# EAGLE design AS226279_ECE319K_Baseline_Schematic (EAGLE 9.6.2)
Spring 2022 EE319K/EE319H This is the baseline schematic
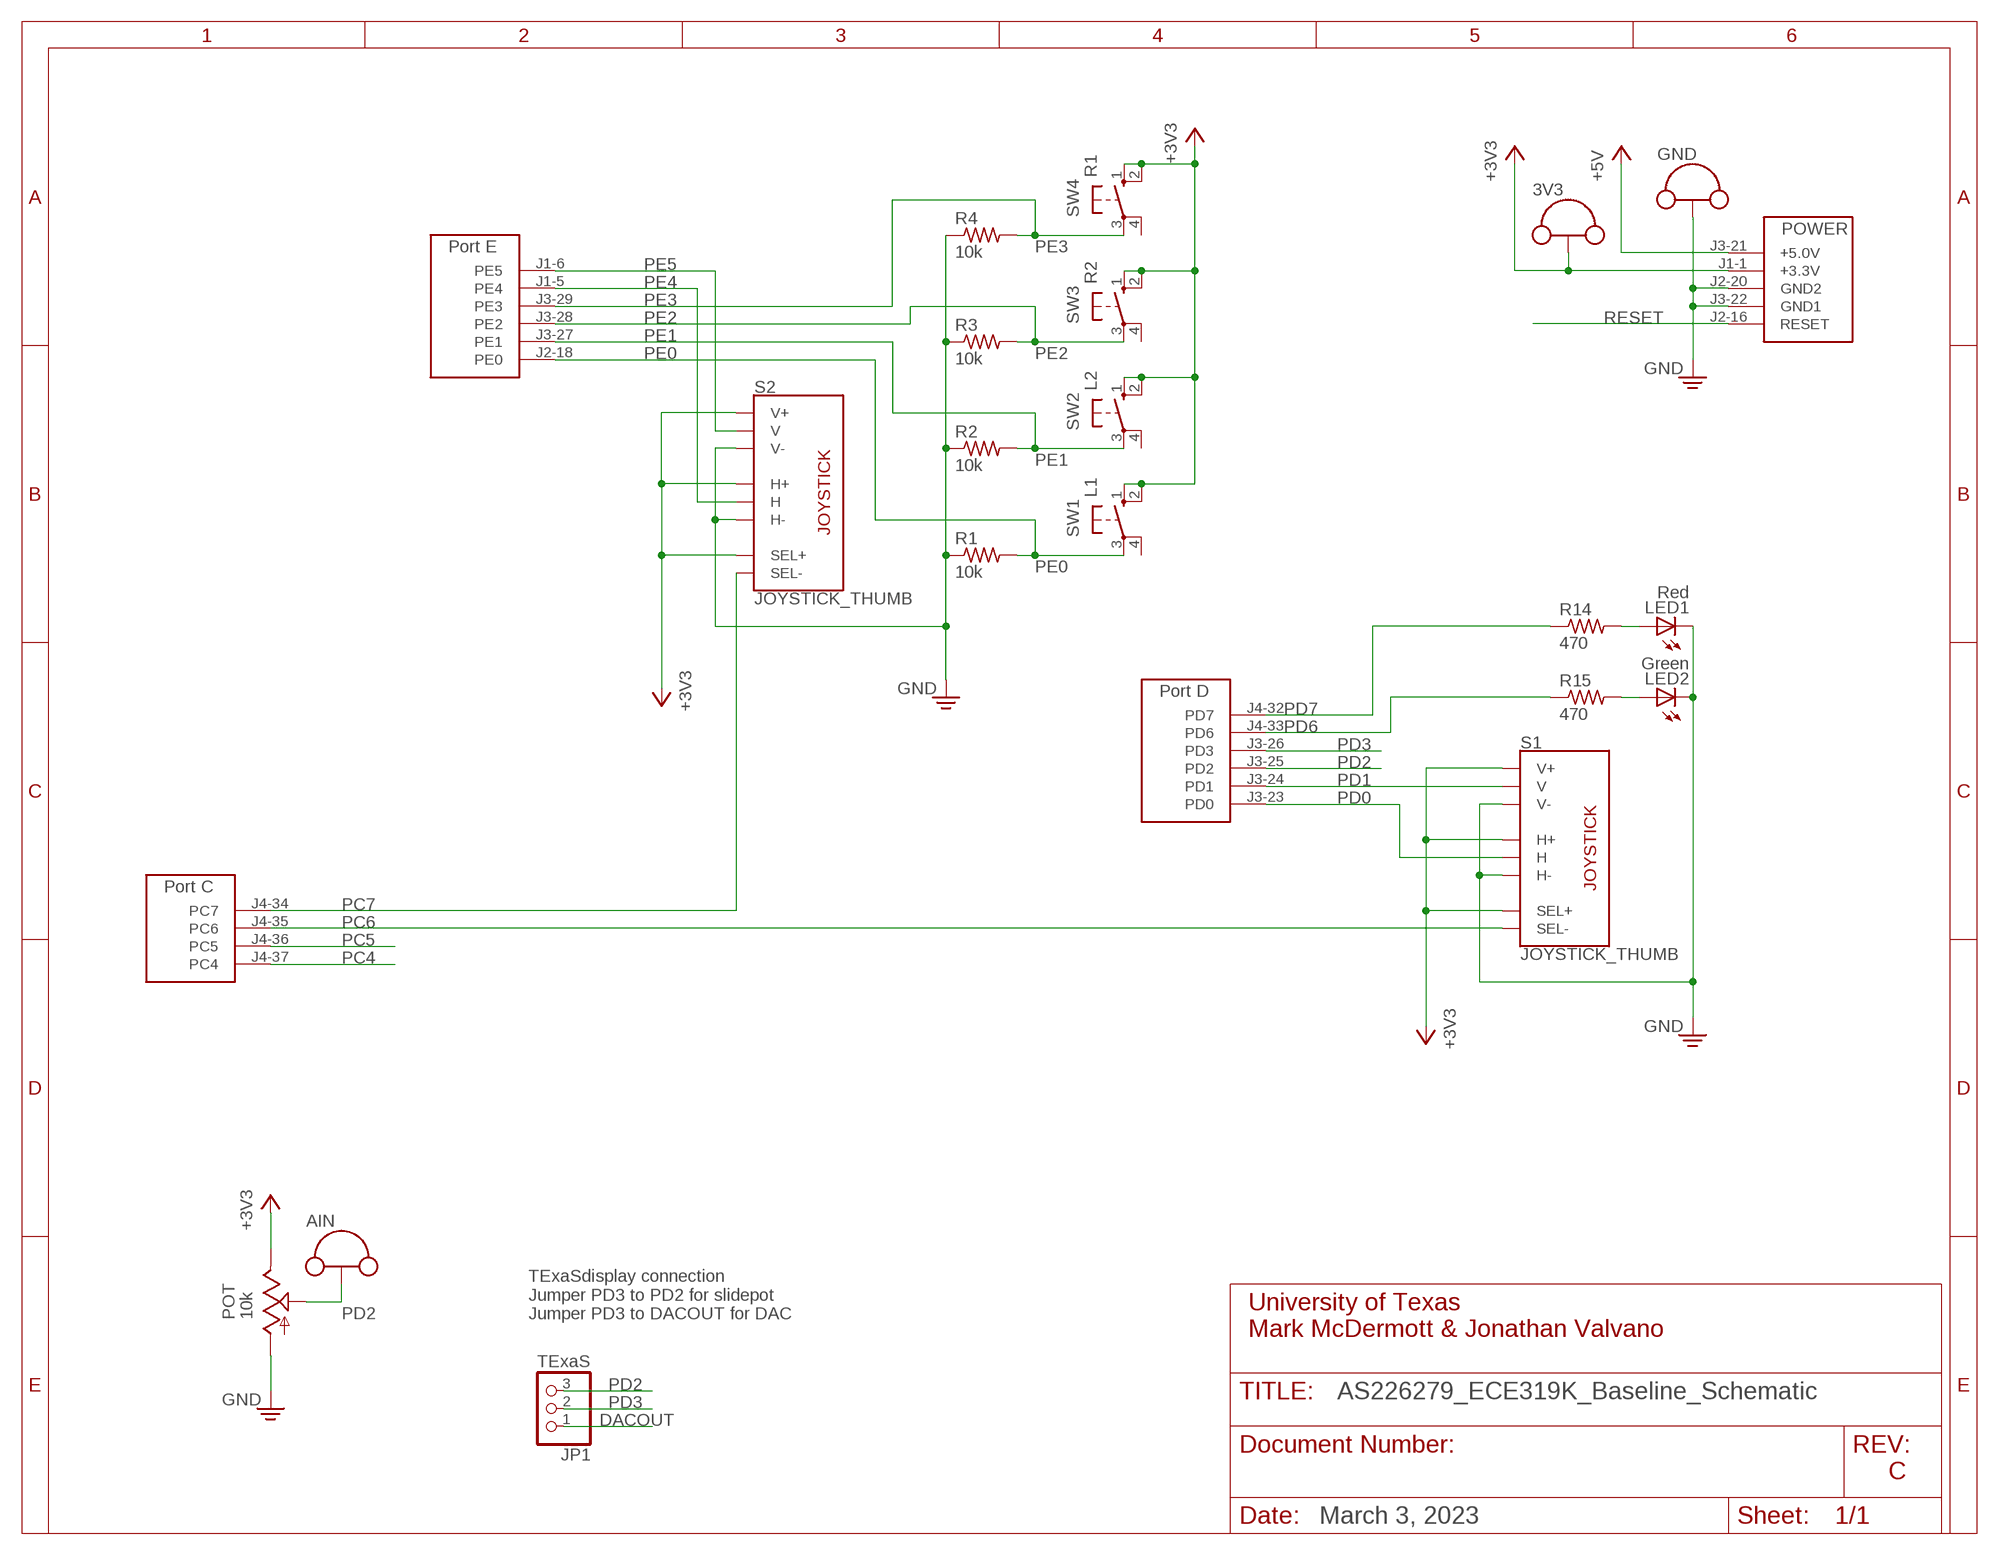
[diagram p0: schematic, sheet 1, part 1 of 2]
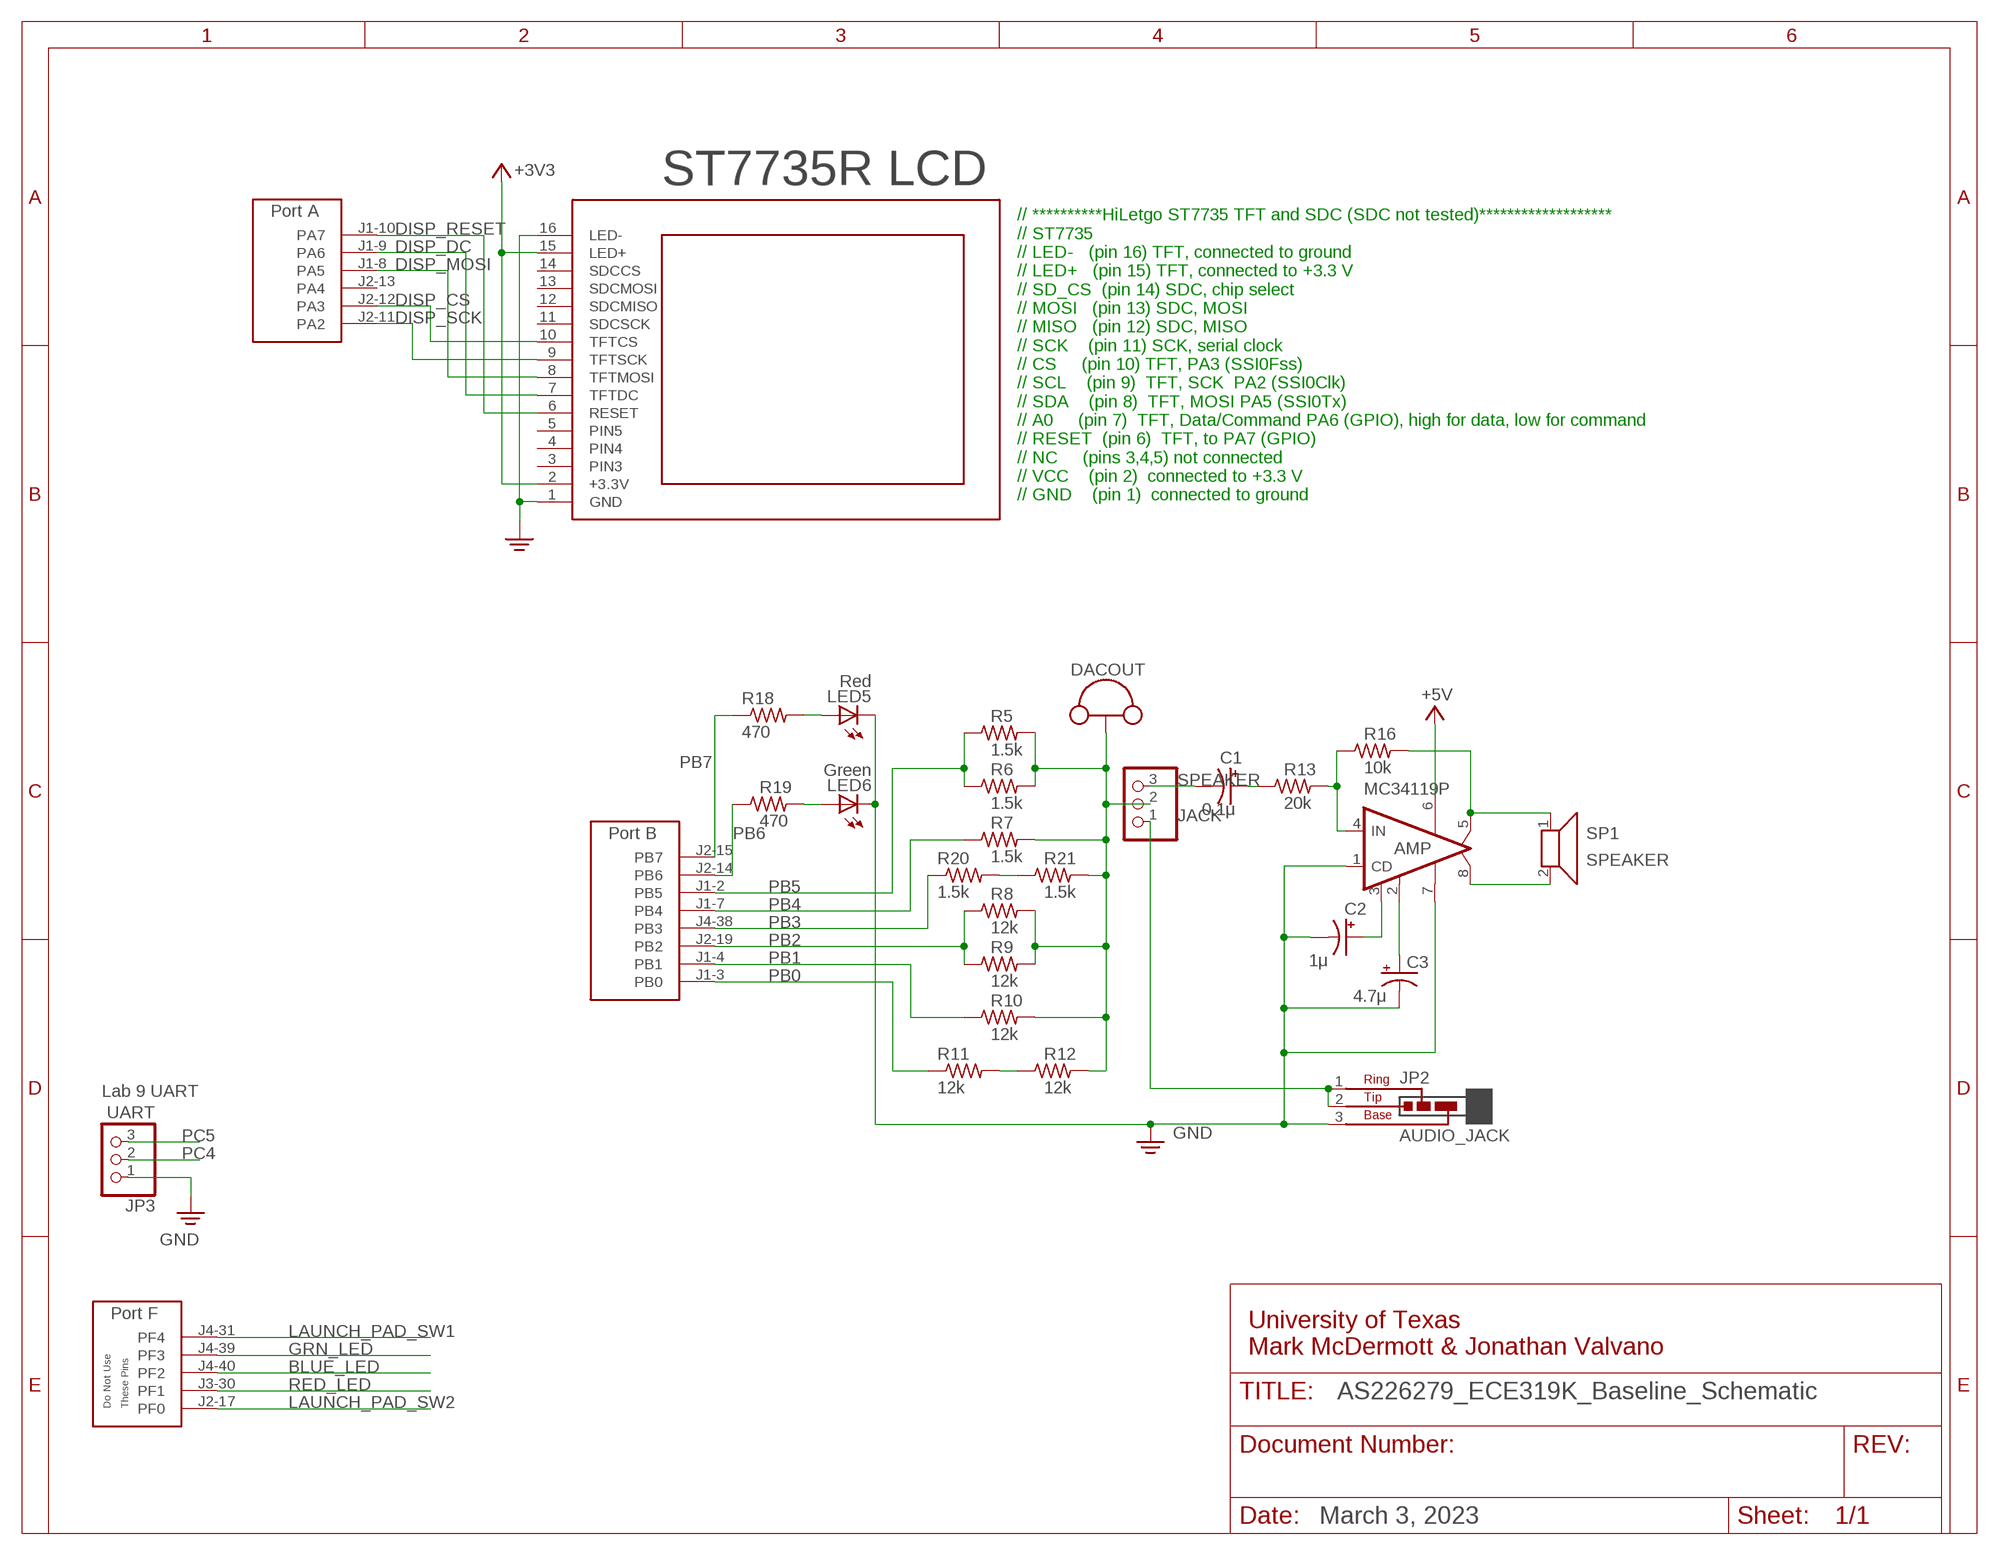
[diagram p1: schematic, sheet 1, part 2 of 2]

## Parts
3V3  TP_LOOP  [TP_LOOP]
AIN  TP_LOOP  [TP_LOOP]
AMP  MC34119P  [DIL08]
C1  0.1μ  CAPACITOR_POLARIZEDE5-6  [CAP200MILPOLARIZED]
C2  1μ  CAPACITOR_POLARIZEDE5-6  [CAP200MILPOLARIZED]
C3  4.7μ  CAPACITOR_POLARIZEDE5-6  [CAP200MILPOLARIZED]
DACOUT  TP_LOOP  [TP_LOOP]
DACOUT_HEADER  TExaS  PINHD-1X3  [1X03]
GND  TP_LOOP  [TP_LOOP]
JP1  TExaS  PINHD-1X3  [1X03]
JP2  AUDIO_JACK  [JACK]
JP3  UART  PINHD-1X3  [1X03]
LED1  Red  LED5MM  [LED5MM]
LED2  Green  LED5MM  [LED5MM]
LED5  Red  LED5MM  [LED5MM]
LED6  Green  LED5MM  [LED5MM]
POT  10k  POTENTIOMETER_PTA2043B25U  [PTA2043]
R1  10k  RESISTOR0204/7  [RES300MIL]
R2  10k  RESISTOR0204/7  [RES300MIL]
R3  10k  RESISTOR0204/7  [RES300MIL]
R4  10k  RESISTOR0204/7  [RES300MIL]
R5  1.5k  RESISTOR0204/7  [RES300MIL]
R6  1.5k  RESISTOR0204/7  [RES300MIL]
R7  1.5k  RESISTOR0204/7  [RES300MIL]
R8  12k  RESISTOR0204/7  [RES300MIL]
R9  12k  RESISTOR0204/7  [RES300MIL]
R10  12k  RESISTOR0204/7  [RES300MIL]
R11  12k  RESISTOR0204/7  [RES300MIL]
R12  12k  RESISTOR0204/7  [RES300MIL]
R13  20k  RESISTOR0204/7  [RES300MIL]
R14  470  RESISTOR0204/7  [RES300MIL]
R15  470  RESISTOR0204/7  [RES300MIL]
R16  10k  RESISTOR0204/7  [RES300MIL]
R18  470  RESISTOR0204/7  [RES300MIL]
R19  470  RESISTOR0204/7  [RES300MIL]
R20  1.5k  RESISTOR0204/7  [RES300MIL]
R21  1.5k  RESISTOR0204/7  [RES300MIL]
S1  JOYSTICK_THUMB  [JOYSTICK]
S2  JOYSTICK_THUMB  [JOYSTICK]
SP1  SPEAKER  [1X02]
SW1  L1  B3F-1052  [B3F-10XX]
SW2  L2  B3F-1052  [B3F-10XX]
SW3  R2  B3F-1052  [B3F-10XX]
SW4  R1  B3F-1052  [B3F-10XX]
U$1  HILETGO  [HILETGO]
U$2  TM4C_BP  [TM4C_BOOSTER_PACK]

## Nets
+3V3: 3V3.P$1(TP) 3V3.P$2(TP) POT.1(E) S1.B1A(SEL+) S1.H1(H+) S1.V1(V+) S2.B1A(SEL+) S2.H1(H+) S2.V1(V+) SW1.1(S) SW1.2(S1) SW2.1(S) SW2.2(S1) SW3.1(S) SW3.2(S1) SW4.1(S) SW4.2(S1) U$1.2(+3.3V) U$1.15(LED+) U$2.J1-1(+3.3V)
+5V: AMP.6(VCC) U$2.J3-21(+5.0V)
BLUE_LED: U$2.J4-40(PF2)
DACOUT: DACOUT.P$1(TP) DACOUT.P$2(TP) DACOUT_HEADER.2 JP1.1 R5.2 R6.2 R7.2 R8.2 R9.2 R10.2 R12.2 R21.2
DISP_CS: U$1.10(TFTCS) U$2.J2-12(PA3)
DISP_DC: U$1.7(TFTDC) U$2.J1-9(PA6)
DISP_MOSI: U$1.8(TFTMOSI) U$2.J1-8(PA5)
DISP_RESET: U$1.6(RESET) U$2.J1-10(PA7)
DISP_SCK: U$1.9(TFTSCK) U$2.J2-11(PA2)
GND: AMP.1(CD) AMP.7(GND) C2.- C3.- GND.P$1(TP) GND.P$2(TP) JP2.3(BASE) JP3.1 LED1.K(C) LED2.K(C) LED5.K(C) LED6.K(C) POT.3(A) R1.1 R2.1 R3.1 R4.1 S1.H3(H-) S1.V3(V-) S2.H3(H-) S2.V3(V-) U$1.1(GND) U$1.16(LED-) U$2.J2-20(GND2) U$2.J3-22(GND1)
GRN_LED: U$2.J4-39(PF3)
JACK: DACOUT_HEADER.1 JP2.1(RING) JP2.2(TIP)
LAUNCH_PAD_SW1: U$2.J4-31(PF4)
LAUNCH_PAD_SW2: U$2.J2-17(PF0)
N$1: LED1.A R14.2
N$2: R11.2 R12.1
N$5: LED2.A R15.2
N$6: LED6.A R19.2
N$7: LED5.A R18.2
N$12: R20.2 R21.1
N$13: AMP.5(VO1) R16.2 SP1.1
N$14: AMP.8(VO2) SP1.2
N$15: C1.+ R13.1
N$16: AMP.4(IN) R13.2 R16.1
N$17: AMP.3(FC1) C2.+
N$18: AMP.2(FC2) C3.+
PB0: R11.1 U$2.J1-3(PB0)
PB1: R10.1 U$2.J1-4(PB1)
PB2: R8.1 R9.1 U$2.J2-19(PB2)
PB3: R20.1 U$2.J4-38(PB3)
PB4: R7.1 U$2.J1-7(PB4)
PB5: R5.1 R6.1 U$2.J1-2(PB5)
PB6: R19.1 U$2.J2-14(PB6)
PB7: R18.1 U$2.J2-15(PB7)
PC4: JP3.2 U$2.J4-37(PC4)
PC5: JP3.3 U$2.J4-36(PC5)
PC6: S1.B2A(SEL-) U$2.J4-35(PC6)
PC7: S2.B2A(SEL-) U$2.J4-34(PC7)
PD0: S1.H2(H) U$2.J3-23(PD0)
PD1: S1.V2(V) U$2.J3-24(PD1)
PD2: AIN.P$1(TP) AIN.P$2(TP) JP1.3 POT.2(S) U$2.J3-25(PD2)
PD3: JP1.2 U$2.J3-26(PD3)
PD6: R15.1 U$2.J4-33(PD6)
PD7: R14.1 U$2.J4-32(PD7)
PE0: R1.2 SW1.3(P) U$2.J2-18(PE0)
PE1: R2.2 SW2.3(P) U$2.J3-27(PE1)
PE2: R3.2 SW3.3(P) U$2.J3-28(PE2)
PE3: R4.2 SW4.3(P) U$2.J3-29(PE3)
PE4: S2.H2(H) U$2.J1-5(PE4)
PE5: S2.V2(V) U$2.J1-6(PE5)
RED_LED: U$2.J3-30(PF1)
RESET: U$2.J2-16(RESET)
SPEAKER: C1.- DACOUT_HEADER.3
Unconnected: SW1.4(P1) SW2.4(P1) SW3.4(P1) SW4.4(P1) U$1.3(PIN3) U$1.4(PIN4) U$1.5(PIN5) U$1.11(SDCSCK) U$1.12(SDCMISO) U$1.13(SDCMOSI) U$1.14(SDCCS) U$2.J2-13(PA4)

## Notes on the sheet
- ST7735R LCD
- // **********HiLetgo ST7735 TFT and SDC (SDC not tested)*******************
  // ST7735
  // LED-   (pin 16) TFT, connected to ground
  // LED+   (pin 15) TFT, connected to +3.3 V
  // SD_CS  (pin 14) SDC, chip select
  // MOSI   (pin 13) SDC, MOSI
  // MISO   (pin 12) SDC, MISO
  // SCK    (pin 11) SCK, serial clock
  // CS     (pin 10) TFT, PA3 (SSI0Fss)
  // SCL    (pin 9)  TFT, SCK  PA2 (SSI0Clk)
  // SDA    (pin 8)  TFT, MOSI PA5 (SSI0Tx)
  // A0     (pin 7)  TFT, Data/Command PA6 (GPIO), high for data, low for command
  // RESET  (pin 6)  TFT, to PA7 (GPIO)
  // NC     (pins 3,4,5) not connected
  // VCC    (pin 2)  connected to +3.3 V
  // GND    (pin 1)  connected to ground
- Lab 9 UART
- TExaSdisplay connection
  Jumper PD3 to PD2 for slidepot
  Jumper PD3 to DACOUT for DAC
- University of Texas
  Mark McDermott & Jonathan Valvano
- University of Texas
  Mark McDermott & Jonathan Valvano
- C
- March 3, 2023 | March 3, 2023

## Library data of the parts
3V3 AIN DACOUT GND = EE445L:TP_LOOP
AMP = EE445L:MC34119: Low Power Audio Amplifier Motorola
C1-C3 = EE445L:CAPACITOR_POLARIZED: POLARIZED CAPACITOR, American symbol
DACOUT_HEADER JP1 JP3 = EE445L:PINHD-1X3: PIN HEADER
JP2 = EE445L:AUDIO_JACK: Audio Jack Stereo Jack 3pin 3.5mm, CUI, SJ1-3553NG, CP1-3553NG-ND; OC_FARNELL: unknown; OC_NEWARK: unknown
LED1 LED2 LED5 LED6 = EE445L:LED: Avago Technologies LED Green 2mA 5mm diffused, HLMP-4740, Digikey 516-1327-ND Red 1.6V 1mA 5mm diffused, HLMP-D150, Digikey 516-1323-ND Yellow 2mA 5mm diffused, HLMP-4719, Digikey 516-1326-ND Orange 10mA 5mm diffused HLMP-D401, Digikey 516-1330-ND Blue 10mA 5mm diffused
POT = EE445L:POTENTIOMETER_PTA2043: POTENTIOMETER Warning There are many many sizes and shapes of potentiometers. Please verify both the wiring and the physical layout of your pots.
R1-R16 R18-R21 = EE445L:RESISTOR: RESISTOR, American symbol
S1 S2 = SparkFun-Switches:JOYSTICK_THUMB: Analog Thumb Joystick This is a joystick very similar to the ‘analog’ joysticks on PS2 (PlayStation 2) controllers. Directional movements are simply two potentiometers - one for each axis. Pots are ~10k each. This joystick also has a select button that is actuated when the joystick is pressed down. SparkFun Products Thumb Joystick <https://www.sparkfun.com/products/9032> (COM-09032) SparkFun Thumb Joystick Breakout <https://www.sparkfun.com/products/9110> (BOB-09110) SparkFun Joystick Shield Kit <https://www.sparkfun.com/products/9760> (DEV-09760); PROD_ID: COMP-09744; SF_SKU: COM-09032
SP1 = EE445L:SPEAKER: Speaker Connected off PCB with two wires. 32-ohm speaker, AllElectronics, SK-230, http://www.allelectronics.com/make-a-store/item/sk-230/20-mm-32-ohm-speaker/1.html
SW1-SW4 = EE445L:B3F-1052: OMRON SWITCH 1.1mm holes; MPN: B3F-1000; OC_FARNELL: 176432; OC_NEWARK: 36M3542
U$1 = EE445L:HILETGO: HiLetgo ST7735 TFT and SDC // GND (pin 1) connected to ground // VCC (pin 2) connected to +3.3 V // NC (pins 3,4,5) not connected // RESET (pin 6) TFT, to PA7 (GPIO) // A0 (pin 7) TFT, Data/Command PA6 (GPIO), high for data, low for command // SDA (pin 8) TFT, MOSI PA5 (SSI0Tx) // SCL (pin 9) TFT, SCK PA2 (SSI0Clk) // CS (pin 10) TFT, PA3 (SSI0Fss) // SCK (pin 11) SDC, serial clock, also connect to PA2 ST7735_SCK // MISO (pin 12) SDC, MISO, connect to PA4 ST7735_MISO // MOSI (pin 13) SDC, MOSI, also connect to ST7735_MOSI PA5 // SD_CS (pin 14) SDC, chip select, connect to PD7 // LED+ (pin 15) TFT, connected to +3.3 V // LED- (pin 16) TFT, connected to ground
U$2 = EE445L:TM4C_BP

## Board
Spring 2022 EE319K/EE319H This is the baseline PCB
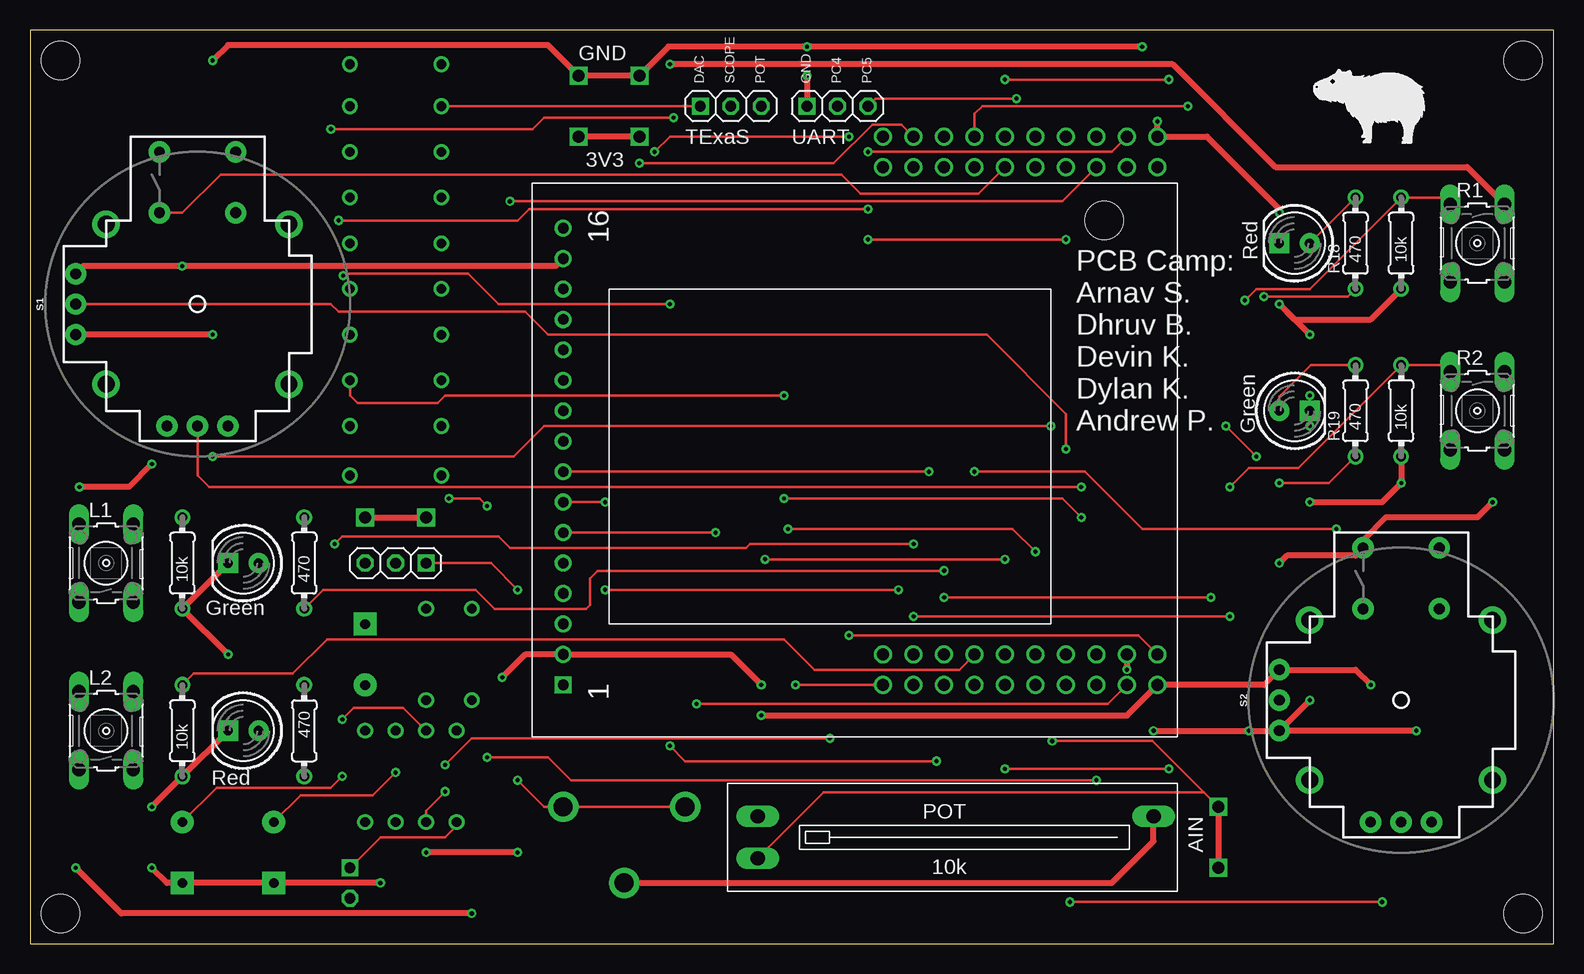
[diagram p2: board, top side]
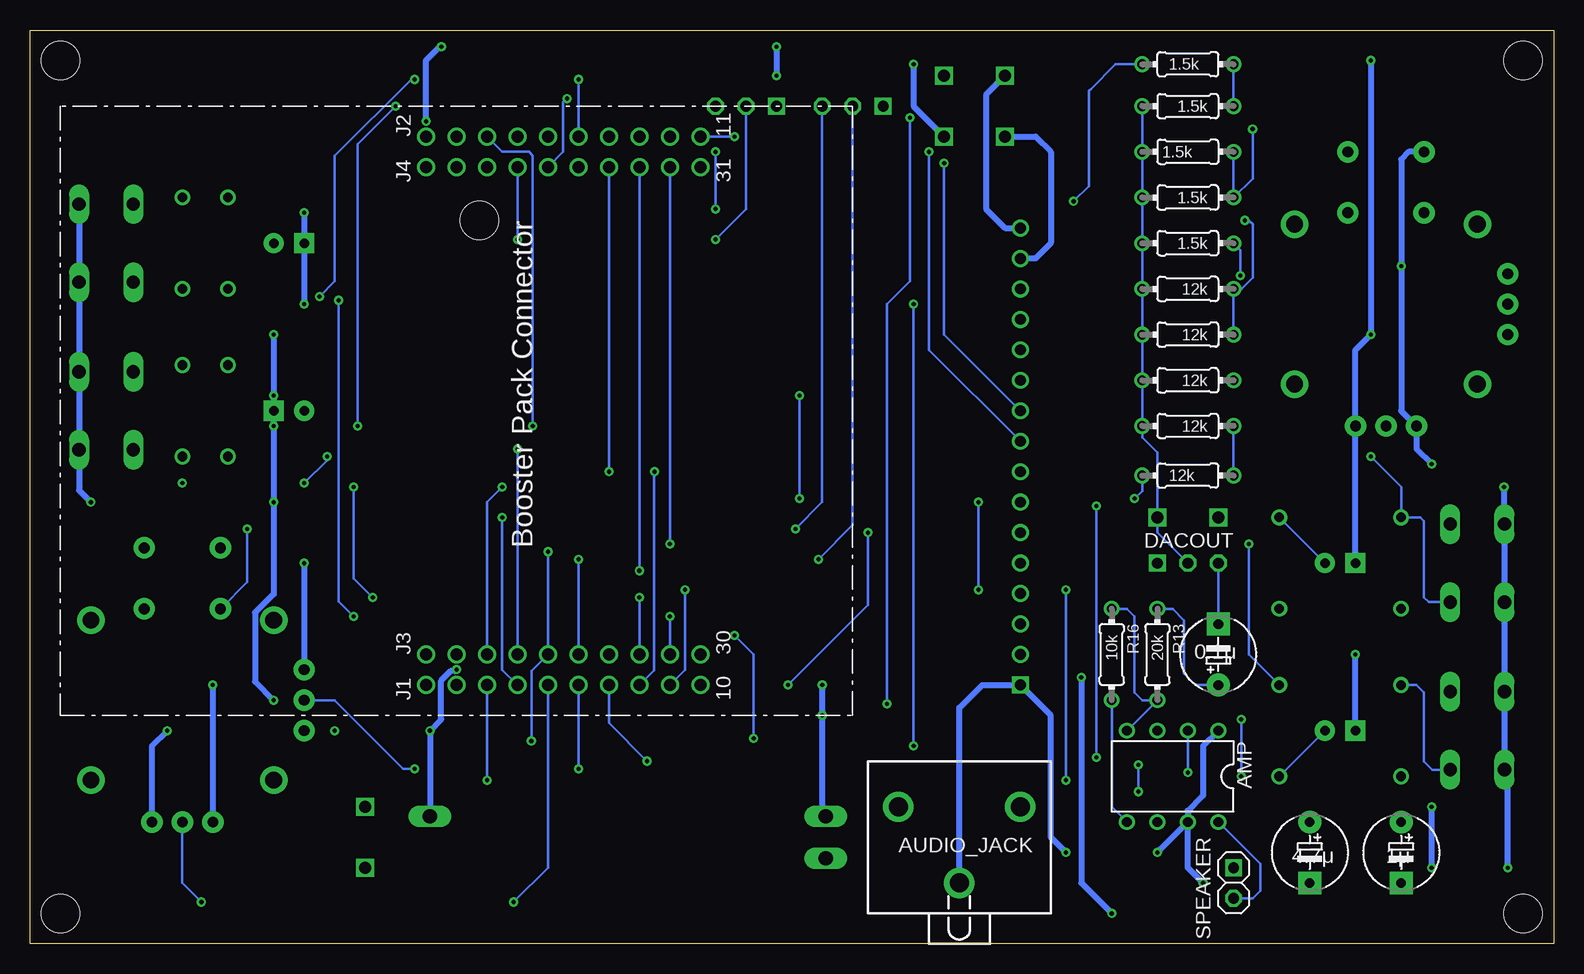
[diagram p3: board, bottom side, seen from below]

Size 127 x 76.2 mm. Coordinates in mm from the lower left corner, seen from the top.
Outline: 0,0 127,0 127,76.2 0,76.2 0,0
Copper layers (1*16): Top 0.035mm / dielectric 1.5mm / Bottom 0.035mm
Design rules "default": minimum track width 6mil, minimum drill 0.35mm, track to track 6mil, track to pad 6mil, pad to pad 6mil, via to via 6mil, smd to smd 6mil, copper to edge 40mil, drill to drill 6mil, minimum pad ring 10mil, minimum via ring 8mil, stop-mask expansion 4mil, vias tented up to drill 0mil, thermal gap 10mil
Holes 3.17 mm at 2.54,73.66 124.46,73.66 124.46,2.54 2.54,2.54

### Footprints (pad centres in the part's own frame; a part is rotated, then mirrored left to right if it is on the bottom)
TP_LOOP = drill 1 square: P$1 0,0; P$2 5.08,0
DIL08 = drill 0.813 pad 1.27: 1 -3.81,-3.81; 2 -1.27,-3.81; 3 1.27,-3.81; 4 3.81,-3.81; 5 3.81,3.81; 6 1.27,3.81; 7 -1.27,3.81; 8 -3.81,3.81
CAP200MILPOLARIZED = drill 0.8 pad 1.905: + -2.54,0 | drill 0.8 pad 1.905 square: - 2.54,0
1X03 = drill 0.9 square: 1 -2.54,0 | drill 0.9 octagon: 2 0,0; 3 2.54,0
JACK = drill 1.587 pad 2.54: 1 -5.08,2.54; 2 5.08,2.54; 3 0,-3.81
LED5MM = drill 0.8 pad 1.676: A -1.27,0 | drill 0.8 pad 1.676 square: K 1.27,0
PTA2043 = drill 1.194 long: 1 -13,1.75; 2 -13,-1.75; 3 20,1.75
RES300MIL = drill 0.8: 1 -3.81,0; 2 3.81,0
JOYSTICK = drill 0.9 pad 1.778: B1A -3.175,12.7; B1B 3.175,12.7; B2A -3.175,7.62; B2B 3.175,7.62 | drill 0.889 pad 1.778: H1 -2.54,-10.16; H2 0,-10.16; H3 2.54,-10.16; V1 -10.16,2.54; V2 -10.16,0; V3 -10.16,-2.54 | drill 1.397 pad 2.286: MOUNT1 -7.62,6.668; MOUNT2 -7.62,-6.668; MOUNT3 7.62,-6.668; MOUNT4 7.62,6.668
1X02 = drill 0.9 square: 1 -1.27,0 | drill 0.9 octagon: 2 1.27,0
B3F-10XX = drill 1.1 long: 1 -3.251,2.261; 2 3.251,2.261; 3 -3.251,-2.261; 4 3.251,-2.261
HILETGO = drill 0.9 square: 1 -20.32,25.4 | drill 0.9: 2 -17.78,25.4; 3 -15.24,25.4; 4 -12.7,25.4; 5 -10.16,25.4; 6 -7.62,25.4; 7 -5.08,25.4; 8 -2.54,25.4; 9 0,25.4; 10 2.54,25.4; 11 5.08,25.4; 12 7.62,25.4; 13 10.16,25.4; 14 12.7,25.4; 15 15.24,25.4; 16 17.78,25.4 | hole 3.175: 18.415,-19.685
TM4C_BOOSTER_PACK = drill 1: J1-1 0,22.86; J1-2 0,20.32; J1-3 0,17.78; J1-4 0,15.24; J1-5 0,12.7; J1-6 0,10.16; J1-7 0,7.62; J1-8 0,5.08; J1-9 0,2.54; J1-10 0,0; J2-11 45.72,0; J2-12 45.72,2.54; J2-13 45.72,5.08; J2-14 45.72,7.62; J2-15 45.72,10.16; J2-16 45.72,12.7; J2-17 45.72,15.24; J2-18 45.72,17.78; J2-19 45.72,20.32; J2-20 45.72,22.86; J3-21 2.54,22.86; J3-22 2.54,20.32; J3-23 2.54,17.78; J3-24 2.54,15.24; J3-25 2.54,12.7; J3-26 2.54,10.16; J3-27 2.54,7.62; J3-28 2.54,5.08; J3-29 2.54,2.54; J3-30 2.54,0; J4-31 43.18,0; J4-32 43.18,2.54; J4-33 43.18,5.08; J4-34 43.18,7.62; J4-35 43.18,10.16; J4-36 43.18,12.7; J4-37 43.18,15.24; J4-38 43.18,17.78; J4-39 43.18,20.32; J4-40 43.18,22.86

### Placement (x,y rotation side)
3V3  50.8,67.31 180 top
AIN  99.06,6.35 90 top
AMP  31.75,13.97 180 bottom
C1  27.94,24.13 90 bottom
C2  12.7,7.62 270 bottom
C3  20.32,7.62 270 bottom
DACOUT  27.94,35.56 180 bottom
DACOUT_HEADER  30.48,31.75 180 top
GND  45.72,72.39 0 top
JP1  58.42,69.85 0 top
JP2  49.53,8.89 0 bottom
JP3  67.31,69.85 0 top
LED1  17.78,17.78 180 top
LED2  17.78,31.75 180 top
LED5  105.41,58.42 180 top
LED6  105.41,44.45 0 top
POT  73.66,8.89 0 top
R1  12.7,31.75 90 top
R2  12.7,17.78 90 top
R3  114.3,44.45 90 top
R4  114.3,58.42 90 top
R5  30.48,66.04 180 bottom
R6  30.48,62.23 180 bottom
R7  30.48,58.42 180 bottom
R8  30.48,54.61 180 bottom
R9  30.48,50.8 180 bottom
R10  30.48,46.99 180 bottom
R11  30.48,39.05 0 bottom
R12  30.48,43.18 180 bottom
R13  33.02,24.13 270 bottom
R14  22.86,17.78 270 top
R15  22.86,31.75 90 top
R16  36.83,24.13 270 bottom
R18  110.49,58.42 90 top
R19  110.49,44.45 90 top
R20  30.48,73.34 0 bottom
R21  30.48,69.85 180 bottom
S1  13.97,53.34 0 top
S2  114.3,20.32 0 top
SP1  26.67,5.08 270 bottom
SW1  6.35,31.75 90 top
SW2  6.35,17.78 90 top
SW3  120.65,44.45 270 top
SW4  120.65,58.42 270 top
U$1  69.85,41.91 90 top
U$2  71.12,21.59 90 bottom

### Tracks (layer width: path | path; a pad name or v marks a point on that pad's centre or on a via)
+3V3  (via drill 0.35)
  Top 0.508: 3V3.P$1 3V3.P$2 | U$1.15 43.81,56.52 v12.7,56.52 4.45,56.52 S1.V1 | v53.34,73.34 95.25,73.34 103.82,64.77 119.81,64.77 SW4.1 | v121.92,36.83 120.65,35.56 113.03,35.56 111.12,33.66 S2.B1A 110.49,32.38 104.78,32.38 v104.14,31.75 | v111.76,21.59 110.49,22.86 S2.V1 102.87,21.59 U$2.J1-1 91.44,19.05 v60.96,19.05 | v10.16,40.01 8.26,38.1 v4.13,38.1 | v60.96,21.59 58.42,24.13 U$1.2 41.27,24.13 v39.37,22.23 | v36.83,2.54 7.62,2.54 v3.81,6.35
  Bottom 0.508: U$1.15 43.18,57.15 41.91,58.42 41.91,66.04 43.18,67.31 3V3.P$2 | S1.B1A 12.06,66.04 12.7,65.41 v12.7,56.52 12.7,44.45 S1.H1 11.43,41.27 v10.16,40.01 | 3V3.P$1 53.34,69.85 v53.34,73.34 | SW4.1 SW4.2 SW3.1 SW3.2 122.91,37.82 v121.92,36.83 | v104.14,31.75 S2.V1 | v111.76,21.59 S2.H1 | v60.96,21.59 v60.96,19.05 60.96,10.94 POT.1 | v39.37,22.23 39.37,5.08 v36.83,2.54 | v3.81,6.35 3.81,14.33 4.09,14.61 SW2.1 SW2.2 SW1.1 SW1.2 4.13,35.04 v4.13,38.1
+5V  (via drill 0.35)
  Top 0.203: AMP.6 33.02,11.11 v34.61,12.7 | v68.26,25.72 92.39,25.72 U$2.J3-21 | v34.61,14.92 36.83,17.14 v66.67,17.14
  Bottom 0.203: v66.67,17.14 66.67,24.13 v68.26,25.72 | v34.61,14.92 v34.61,12.7
DACOUT
  Top 0.203: JP1.1 R21.2
  Top 0.508: DACOUT.P$1 DACOUT.P$2
  Bottom 0.203: DACOUT_HEADER.2 33.02,34.29 DACOUT.P$2 33.02,40.96 34.29,42.23 R12.2 R10.2 R9.2 R8.2 R7.2 R6.2 R5.2 R21.2
DISP_CS  (via drill 0.35)
  Top 0.203: v50.8,65.09 66.99,65.09 70.22,68.32 72.65,68.32 U$2.J2-12
  Bottom 0.203: U$1.10 50.8,50.8 v50.8,65.09
DISP_DC  (via drill 0.35)
  Top 0.203: v47.94,36.83 U$1.7 | v72.39,29.53 v47.94,29.53
  Bottom 0.203: U$2.J1-9 72.39,22.86 v72.39,29.53 | v47.94,29.53 v47.94,36.83
DISP_MOSI  (via drill 0.35)
  Top 0.203: v74.93,39.37 U$1.8
  Bottom 0.203: v74.93,39.37 74.99,39.31 74.99,22.8 U$2.J1-8
DISP_RESET  (via drill 0.35)
  Top 0.203: U$2.J1-10 v63.82,21.59 | v57.15,34.29 U$1.6
  Bottom 0.203: v57.15,34.29 57.15,28.26 v63.82,21.59
DISP_SCK  (via drill 0.35)
  Top 0.203: v52.07,66.04 53.34,67.31 v68.26,67.31
  Bottom 0.203: U$1.9 52.07,49.53 v52.07,66.04 | v68.26,67.31 U$2.J2-11
GND  (via drill 0.35)
  Top 0.508: U$2.J3-22 v91.44,22.88 | S2.V3 v101.6,17.78 v93.66,17.78 | v104.14,60.96 104.14,61.28 98.11,67.31 U$2.J2-20 v93.98,68.58 | R4.1 111.76,52.07 105.41,52.07 v104.14,53.34 v106.68,50.8 | R3.1 v114.3,38.42 112.71,36.83 v106.68,36.83 | v115.57,17.78 S2.V3 | v106.68,20.32 S2.V3 | v92.71,74.81 v64.77,74.81 53.22,74.81 GND.P$2 GND.P$1 43.18,74.93 16.51,74.93 v15.24,73.66 | v64.77,72.39 JP3.1 | v40.64,7.62 v33.02,7.62 | v29.21,5.08 C3.- C2.- 11.43,5.08 v10.16,6.35 | v10.16,11.43 R2.1 LED1.K | v16.51,24.13 R1.1 LED2.K | v15.24,50.8 S1.V3 | JP2.3 90.17,5.08 93.66,8.57 POT.3
  Bottom 0.508: v91.44,22.88 91.56,22.75 91.92,22.75 92.71,21.96 92.71,18.73 v93.66,17.78 POT.3 | v104.14,60.96 LED5.K v104.14,53.34 | v106.68,50.8 v106.68,45.72 LED6.K v106.68,43.18 v106.68,36.83 106.68,29.18 108.23,27.63 108.23,21.87 v106.68,20.32 | v115.57,17.78 116.84,16.51 S2.H3 | v93.98,68.58 93.98,73.66 92.71,74.93 v92.71,74.81 | v64.77,74.81 v64.77,72.39 | GND.P$1 47.31,70.8 47.31,61.28 45.72,59.69 U$1.16 | JP2.3 49.53,19.68 47.62,21.59 U$1.1 41.91,19.05 41.91,8.89 v40.64,7.62 | v29.21,5.08 30.48,6.35 AMP.7 | v10.16,6.35 v10.16,11.43 | LED1.K v16.51,24.13 | LED2.K S1.H3 16.51,49.53 v15.24,50.8 v15.24,73.66 | AMP.1 29.21,16.51 29.21,12.38 30.48,11.11 AMP.7 | v33.02,7.62 AMP.7
JACK  (via drill 0.35)
  Top 0.203: JP2.1 JP2.2 42.86,11.43 v40.64,13.65 | DACOUT_HEADER.1 38.42,31.75 v40.64,29.53
  Bottom 0.203: v40.64,13.65 v40.64,29.53
N$1
  Bottom 0.203: LED1.A R14.2
N$2
  Bottom 0.203: R12.1 R11.2
N$5
  Bottom 0.203: R15.2 LED2.A
N$6
  Top 0.203: R19.2 106.76,48.26 104.14,45.64 LED6.A
N$7
  Top 0.203: R18.2 LED5.A
N$12
  Bottom 0.203: R20.2 R21.1
N$13
  Top 0.203: SP1.1 29.21,8.89 34.61,8.89 35.56,9.84 AMP.5
  Bottom 0.203: R16.2 36.83,11.43 AMP.5
N$14
  Bottom 0.203: SP1.2 25.08,3.81 24.45,4.45 24.45,6.67 AMP.8
N$15
  Bottom 0.203: R13.1 31.75,27.94 30.8,26.99 30.8,22.54 29.84,21.59 C1.+
N$16
  Bottom 0.203: R16.1 35.56,27.94 34.92,27.3 34.92,20.95 34.29,20.32 R13.2 AMP.4
N$17  (via drill 0.35)
  Top 0.203: C2.+ 15.56,13.02 25.08,13.02 v26.04,13.97 | AMP.3 31.11,19.68 26.99,19.68 v26.04,18.73
  Bottom 0.203: v26.04,18.73 v26.04,13.97
N$18  (via drill 0.35)
  Top 0.203: C3.+ 22.54,12.38 28.57,12.38 v30.48,14.29
  Bottom 0.203: AMP.2 v30.48,14.29
PB0  (via drill 0.35)
  Top 0.203: v88.9,13.65 45.09,13.65 43.18,15.56 v38.1,15.56 | v38.1,36.51 37.47,37.15 v34.92,37.15
  Bottom 0.203: U$2.J1-3 v88.9,13.65 | v38.1,15.56 v38.1,36.51 | v34.92,37.15 34.29,37.78 R11.1
PB1  (via drill 0.35)
  Top 0.203: v87.63,35.56 86.04,37.15 v62.87,37.15 | v62.87,45.72 34.61,45.72 33.97,45.09 27.3,45.09 26.67,45.72 R10.1
  Bottom 0.203: U$2.J1-4 87.63,22.86 v87.63,35.56 | v62.87,37.15 v62.87,45.72
PB2  (via drill 0.35)
  Top 0.203: v25.72,60.33 40.64,60.33 41.59,61.28 v69.85,61.28 | v69.85,66.04 90.17,66.04 U$2.J2-19
  Bottom 0.203: R9.1 R8.1 26.04,54.61 25.08,55.56 25.08,60.01 25.4,60.33 v25.72,60.33 | v69.85,61.28 v69.85,66.04
PB3  (via drill 0.35)
  Top 0.203: v40.01,61.91 86.04,61.91 U$2.J4-38
  Bottom 0.203: R20.1 36.51,73.34 38.58,71.28 38.73,71.12 38.73,63.18 v40.01,61.91
PB4  (via drill 0.35)
  Top 0.203: v75.56,15.24 54.61,15.24 v53.34,16.51 | v26.11,55.73 26.27,55.88 36.51,55.88 39.05,53.34 v53.34,53.34
  Bottom 0.203: U$2.J1-7 78.74,18.41 v75.56,15.24 | v53.34,16.51 v53.34,53.34 | v26.11,55.73 26.11,57.87 R7.1
PB5  (via drill 0.35)
  Top 0.203: v25.08,67.94 41.91,67.94 42.86,68.9 v53.66,68.9 | v55.56,20 89.85,20 U$2.J1-2
  Bottom 0.203: R5.1 R6.1 25.08,63.82 v25.08,67.94 | v55.56,20 55.56,53.34 53.66,55.24 v53.66,68.9
PB6  (via drill 0.35)
  Top 0.203: R19.1 108.27,38.42 v104.14,38.42 | v102.23,40.64 v99.69,43.18 | v96.52,69.85 79.38,69.85 78.74,69.22 U$2.J2-14
  Bottom 0.203: v104.14,38.42 102.23,40.32 v102.23,40.64 | v99.69,43.18 99.69,66.67 v96.52,69.85
PB7  (via drill 0.35)
  Top 0.203: R18.1 109.86,53.98 v102.87,53.98 | v94.93,72.07 v81.28,72.07
  Bottom 0.203: v102.87,53.98 101.6,55.24 101.6,65.72 95.25,72.07 v94.93,72.07 | v81.28,72.07 U$2.J2-15
PC4  (via drill 0.35)
  Top 0.203: v69.85,58.74 v86.36,58.74
  Bottom 0.203: JP3.2 67.31,61.28 v69.85,58.74 | v86.36,58.74 U$2.J4-37
PC5  (via drill 0.35)
  Top 0.203: v82.23,70.48 70.48,70.48 JP3.3
  Bottom 0.203: v82.23,70.48 82.55,70.17 82.55,66.04 U$2.J4-36
PC6
  Top 0.203: S1.B2A 12.7,60.96 15.88,64.14 67.63,64.14 69.22,62.55 79.06,62.55 U$2.J4-35
PC7  (via drill 0.35)
  Top 0.203: v108.9,34.61 92.71,34.61 87.95,39.37 v78.74,39.37
  Bottom 0.203: S2.B2A 108.9,30.16 v108.9,34.61 | v78.74,39.37 U$2.J4-34
PD0  (via drill 0.35)
  Top 0.203: v87.63,38.1 14.92,38.1 13.97,39.05 S1.H2
  Bottom 0.203: U$2.J3-23 88.9,36.83 v87.63,38.1
PD1  (via drill 0.35)
  Top 0.203: S1.V2 25.08,53.34 25.72,52.7 41.27,52.7 43.18,50.8 79.76,50.8 86.36,44.2 v86.36,41.27
  Bottom 0.203: v86.36,41.27 U$2.J3-24
PD2  (via drill 0.35)
  Top 0.203: POT.2 66.14,12.62 97.87,12.62 AIN.P$2 93.57,16.92 v85.21,16.92 | v63.18,34.61 81.92,34.61 v83.82,32.7
  Top 0.508: AIN.P$2 AIN.P$1
  Bottom 0.203: v85.21,16.92 85.21,22.74 U$2.J3-25 v83.82,32.7 | JP1.3 60.96,36.83 v63.18,34.61
PD3  (via drill 0.35)
  Top 0.203: v61.28,32.07 v81.28,32.07
  Bottom 0.203: JP1.2 58.42,34.92 v61.28,32.07 | v81.28,32.07 U$2.J3-26
PD6  (via drill 0.35)
  Top 0.203: v76.2,31.11 47.31,31.11 46.67,30.48 46.67,28.26 46.35,27.94 38.73,27.94 37.15,29.53 24.45,29.53 R15.1
  Bottom 0.203: U$2.J4-33 v76.2,31.11
PD7  (via drill 0.35)
  Top 0.203: v73.66,33.34 60.01,33.34 59.69,33.02 40.01,33.02 39.05,33.97 26.04,33.97 v25.4,33.34
  Bottom 0.203: U$2.J4-32 v73.66,33.34 | v25.4,33.34 25.4,24.13 R14.1
PE0  (via drill 0.35)
  Top 0.203: v15.24,40.64 40.32,40.64 42.86,43.18 v85.09,43.18
  Bottom 0.203: SW1.3 10.4,28.5 10.79,28.89 10.79,35.24 11.11,35.56 R1.2 12.7,38.1 v15.24,40.64 | U$2.J2-18 87.63,66.04 85.41,66.04 85.09,65.72 v85.09,43.18
PE1
  Top 0.203: R2.2 13.65,22.54 21.91,22.54 24.77,25.4 62.87,25.4 65.41,22.86 77.47,22.86 U$2.J3-27
  Bottom 0.203: R2.2 11.43,21.59 10.79,20.95 10.79,15.24 10.08,14.53 SW2.3
PE2  (via drill 0.35)
  Top 0.203: SW3.3 117.83,48.26 R3.2 105.73,39.69 101.6,39.69 v100.01,38.1 | v98.42,28.89 v76.2,28.89
  Bottom 0.203: v100.01,38.1 100.01,30.48 v98.42,28.89 | v76.2,28.89 U$2.J3-28
PE3  (via drill 0.35)
  Top 0.203: SW4.3 117.83,62.23 R4.2 106.68,54.61 102.23,54.61 v101.28,53.66 | v100.01,27.3 v73.66,27.3
  Bottom 0.203: v101.28,53.66 101.28,28.57 v100.01,27.3 | v73.66,27.3 U$2.J3-29
PE4  (via drill 0.35)
  Top 0.203: v112.71,3.49 v86.68,3.49
  Bottom 0.203: S2.H2 114.3,5.08 v112.71,3.49 | v86.68,3.49 83.82,6.35 U$2.J1-5
PE5  (via drill 0.35)
  Top 0.203: v94.93,14.61 v81.28,14.61
  Bottom 0.203: S2.V2 101.6,20.32 95.89,14.61 v94.93,14.61 | v81.28,14.61 U$2.J1-6
SPEAKER
  Bottom 0.203: C1.- DACOUT_HEADER.3

### Text on the board
tPlace: DAC | SCOPE | POT | GND | PC4 | PC5 | PCB Camp: / Arnav S. / Dhruv B. / Devin K. / Dylan K. / Andrew P.